# EAGLE design jangeles (EAGLE 8.3.1)
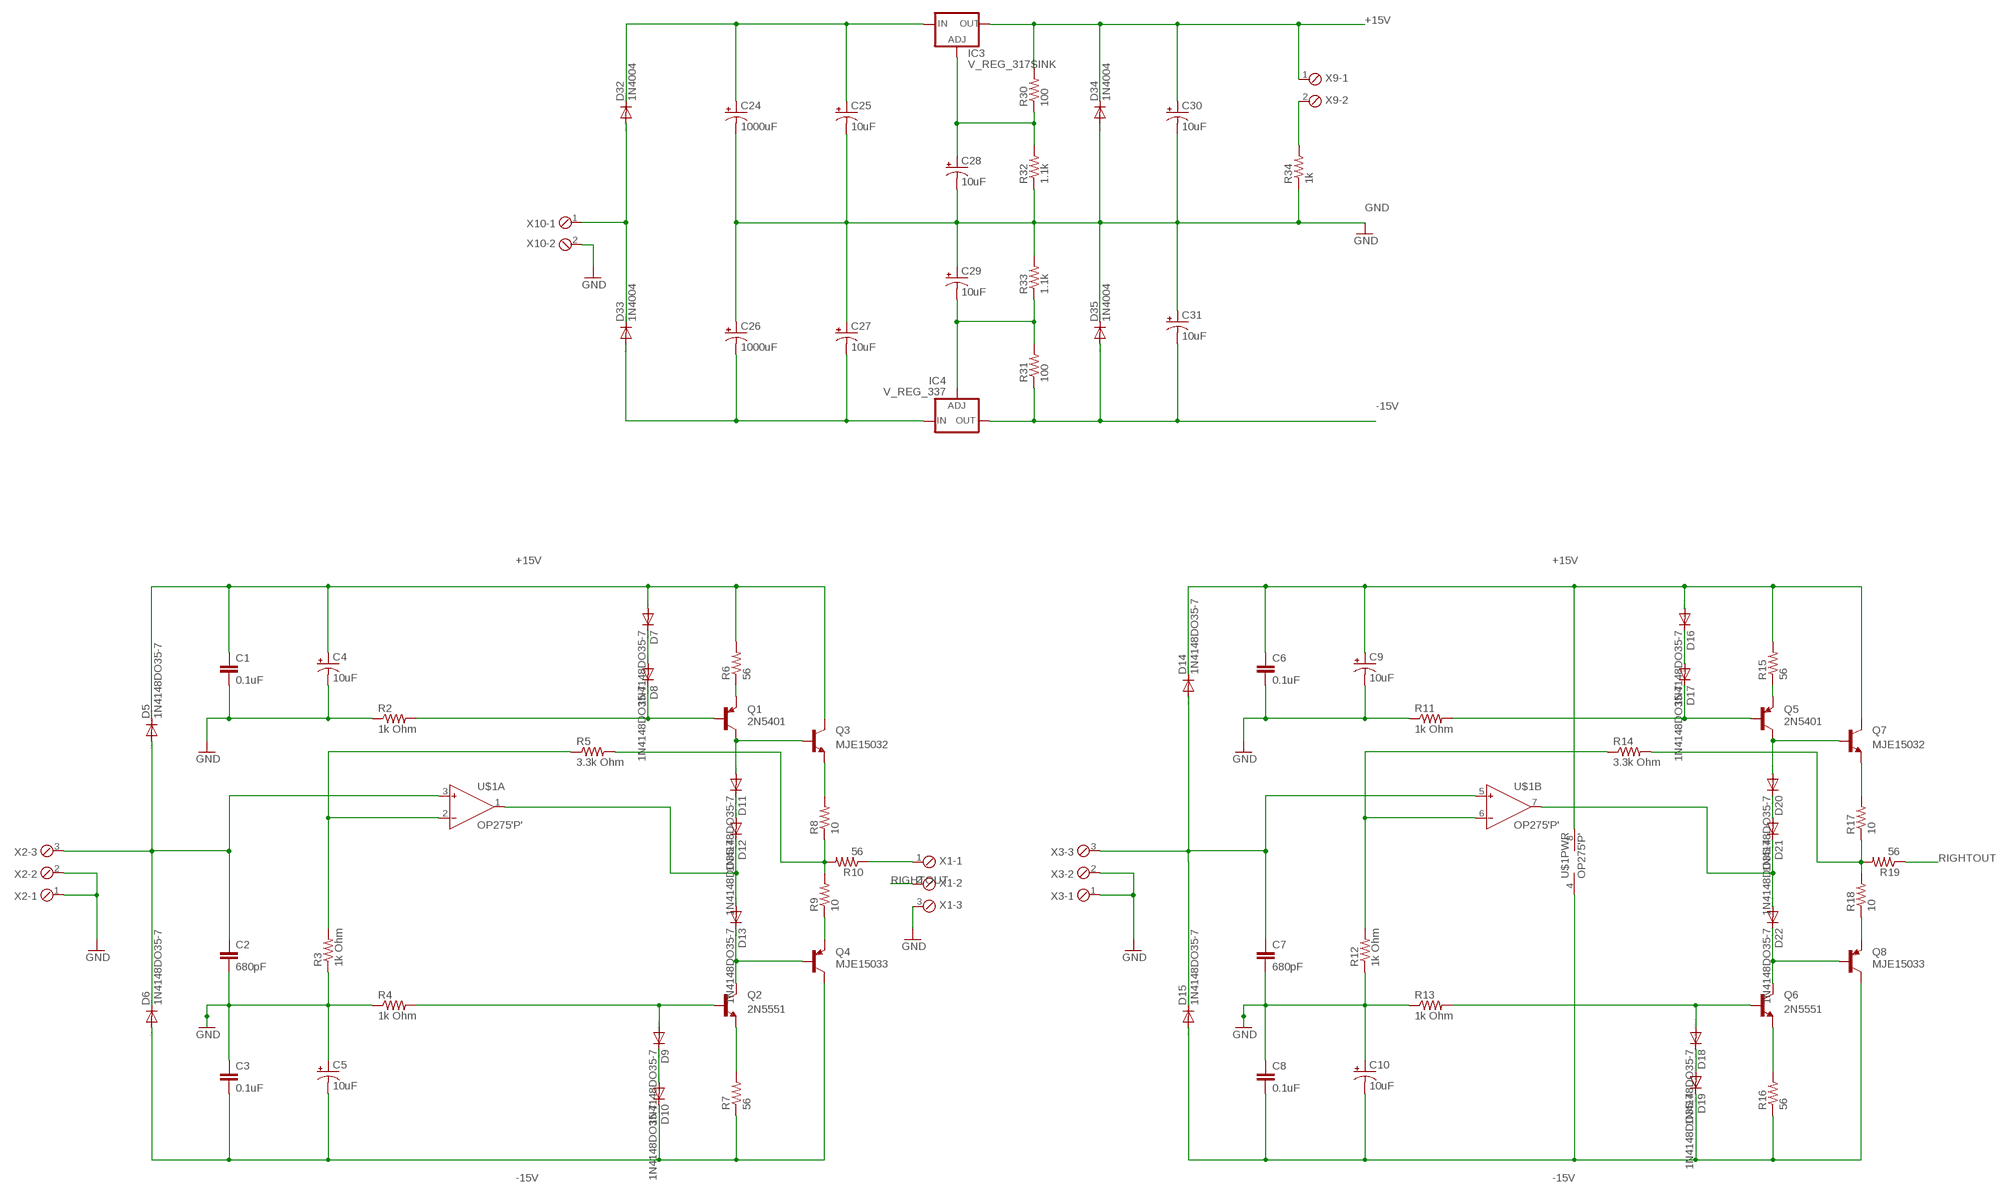
[diagram p0: schematic, sheet 1]

## Parts
C1  0.1uF  C-EU025-024X044  [C025-024X044]
C2  680pF  C-EU025-024X044  [C025-024X044]
C3  0.1uF  C-EU025-024X044  [C025-024X044]
C4  10uF  CPOL-USE2-5  [E2-5]
C5  10uF  CPOL-USE2-5  [E2-5]
C6  0.1uF  C-EU025-024X044  [C025-024X044]
C7  680pF  C-EU025-024X044  [C025-024X044]
C8  0.1uF  C-EU025-024X044  [C025-024X044]
C9  10uF  CPOL-USE2-5  [E2-5]
C10  10uF  CPOL-USE2-5  [E2-5]
C24  1000uF  CPOL-USE5-10.5  [E5-10,5]
C25  10uF  CPOL-USE2-5  [E2-5]
C26  1000uF  CPOL-USE5-10.5  [E5-10,5]
C27  10uF  CPOL-USE2-5  [E2-5]
C28  10uF  CPOL-USE2-5  [E2-5]
C29  10uF  CPOL-USE2-5  [E2-5]
C30  10uF  CPOL-USE2-5  [E2-5]
C31  10uF  CPOL-USE2-5  [E2-5]
D5  1N4148DO35-7  [DO35-7]
D6  1N4148DO35-7  [DO35-7]
D7  1N4148DO35-7  [DO35-7]
D8  1N4148DO35-7  [DO35-7]
D9  1N4148DO35-7  [DO35-7]
D10  1N4148DO35-7  [DO35-7]
D11  1N4148DO35-7  [DO35-7]
D12  1N4148DO35-7  [DO35-7]
D13  1N4148DO35-7  [DO35-7]
D14  1N4148DO35-7  [DO35-7]
D15  1N4148DO35-7  [DO35-7]
D16  1N4148DO35-7  [DO35-7]
D17  1N4148DO35-7  [DO35-7]
D18  1N4148DO35-7  [DO35-7]
D19  1N4148DO35-7  [DO35-7]
D20  1N4148DO35-7  [DO35-7]
D21  1N4148DO35-7  [DO35-7]
D22  1N4148DO35-7  [DO35-7]
D32  1N4004  [DO41-10]
D33  1N4004  [DO41-10]
D34  1N4004  [DO41-10]
D35  1N4004  [DO41-10]
IC3  V_REG_317SINK  [TO220-ADJ]
IC4  V_REG_337  [TO220-ADJ-NEG]
Q1  2N5401  [2N5401]
Q2  2N5551  [2N5551]
Q3  MJE15032  [TO220V]
Q4  MJE15033  [TO220V]
Q5  2N5401  [2N5401]
Q6  2N5551  [2N5551]
Q7  MJE15032  [TO220V]
Q8  MJE15033  [TO220V]
R2  1k Ohm  R-US_0204/5  [0204/5]
R3  1k Ohm  R-US_0204/5  [0204/5]
R4  1k Ohm  R-US_0204/5  [0204/5]
R5  3.3k Ohm  R-US_0204/5  [0204/5]
R6  56  R-US_0204/5  [0204/5]
R7  56  R-US_0204/5  [0204/5]
R8  10  R-US_0204/5  [0204/5]
R9  10  R-US_0204/5  [0204/5]
R10  56  R-US_0204/5  [0204/5]
R11  1k Ohm  R-US_0204/5  [0204/5]
R12  1k Ohm  R-US_0204/5  [0204/5]
R13  1k Ohm  R-US_0204/5  [0204/5]
R14  3.3k Ohm  R-US_0204/5  [0204/5]
R15  56  R-US_0204/5  [0204/5]
R16  56  R-US_0204/5  [0204/5]
R17  10  R-US_0204/5  [0204/5]
R18  10  R-US_0204/5  [0204/5]
R19  56  R-US_0204/5  [0204/5]
R30  100  R-US_0309/10  [0309/10]
R31  100  R-US_0309/10  [0309/10]
R32  1.1k  R-US_0204/5  [0204/5]
R33  1.1k  R-US_0204/5  [0204/5]
R34  1k  R-US_0204/5  [0204/5]
U$1  OP275'P'  [DIL08]
X1  MPT3  [3POL254]
X2  MPT3  [3POL254]
X3  MPT3  [3POL254]
X9  MPT2  [2POL254]
X10  MPT2  [2POL254]

## Nets
+15V [+15v]: C1.1 C4.+ C6.1 C9.+ C30.+ D5.C D7.A D14.C D16.A D34.C IC3.OUT Q3.2(C) Q7.2(C) R6.2 R15.2 R30.2 U$1.8(PWR:V+) X9.1
-15V [-15v]: C3.2 C5.- C8.2 C10.- C31.- D6.A D10.C D15.A D19.C D35.A IC4.OUT Q4.2(C) Q8.2(C) R7.1 R16.1 R31.1 U$1.4(PWR:V-)
GND [GND]: C1.2 C2.2 C3.1 C4.- C5.+ C6.2 C7.2 C8.1 C9.- C10.+ C24.- C25.- C26.+ C27.+ C28.- C29.+ C30.- C31.+ D34.A D35.C R2.1 R3.1 R4.1 R11.1 R12.1 R13.1 R32.1 R33.2 R34.1 X1.3 X2.1 X2.2 X3.1 X3.2 X10.2
N$1: D7.C D8.A
N$2: D9.C D10.A
N$3: Q2.E R7.2
N$4: D9.A Q2.B R4.2
N$5: R3.2 R5.1 U$1.2(A:IN-)
N$6: D18.C D19.A
N$7: Q3.3(E) R8.2
N$8: R5.2 R8.1 R9.2 R10.2
N$9: Q4.3(E) R9.1
N$10: D13.C Q2.C Q4.1(B)
N$12: D12.C D13.A U$1.1(A:OUT)
N$13: D11.C D12.A
N$14: D11.A Q1.C Q3.1(B)
N$15: Q1.E R6.1
N$16: Q6.E R16.2
N$17: D18.A Q6.B R13.2
N$18: D8.C Q1.B R2.2
N$19: Q7.3(E) R17.2
N$20: R14.2 R17.1 R18.2 R19.2
N$21: Q8.3(E) R18.1
N$22: D22.C Q6.C Q8.1(B)
N$24: D21.C D22.A U$1.7(B:OUT)
N$25: D20.C D21.A
N$26: D20.A Q5.C Q7.1(B)
N$27: Q5.E R15.1
N$28: D17.C Q5.B R11.2
N$29: R12.2 R14.1 U$1.6(B:IN-)
N$30: D16.C D17.A
N$31: R10.1 X1.1
N$57: D32.A D33.C X10.1
N$58: C26.- C27.- D33.A IC4.IN
N$60: C24.+ C25.+ D32.C IC3.IN
N$62: C29.- IC4.ADJ R31.2 R33.1
N$64: C28.+ IC3.ADJ R30.1 R32.2
N$67: R34.2 X9.2
R2: C7.1 D14.A D15.C U$1.5(B:IN+) X3.3
R5: C2.1 D5.A D6.C U$1.3(A:IN+) X2.3
RIGHTOUT: R19.1 X1.2

## Library data of the parts
C1-C3 C6-C8 = rcl:C-EU: CAPACITOR, European symbol
C4 C5 C9 C10 C24-C31 = rcl:CPOL-US: POLARIZED CAPACITOR, American symbol
D5-D22 = diode:1N4148: DIODE high speed (Philips)
D32-D35 = diode:1N4004: DIODE general purpose rectifier, 1 A
IC3 = engr301-proj :V_REG_317: Voltage Regulator Standard LM317 adjustable voltage regulator. AOI (Adjust Output Input). Google 'LM317 Calculator' for easy to use app to get the two resistor values needed. 240/720 for 5V output. 240/390 for 3.3V output. Spark Fun Electronics SKU : COM-00527
IC4 = engr301-proj :V_REG_337: LM-337 Negative Adjustable Voltage Regulator
Q1 Q5 = engr301-proj :2N5401
Q2 Q6 = engr301-proj :2N5551
Q3 Q7 = engr301-proj :MJE15032: NPN Power Transistor HF Audio Driver 8.0A, 250V, 50W
Q4 Q8 = engr301-proj :MJE15033: PNP Power Transistor HF Audio Driver 8.0A, 250V, 50W
R2-R19 R30-R34 = rcl:R-US_: RESISTOR, American symbol
U$1 = engr301-proj :OP275: OP275 - Dual Bipolar/JFET Audio Op-amp
X1-X3 = con-phoenix-254:MPT3: PHOENIX CONNECTOR; OC_FARNELL: unknown; OC_NEWARK: unknown
X9 X10 = con-phoenix-254:MPT2: PHOENIX CONNECTOR; OC_FARNELL: unknown; OC_NEWARK: unknown

## Net classes
1 +15v: width 0.762 mm
2 -15v: width 0.762 mm
3 GND: width 0.381 mm

## Board
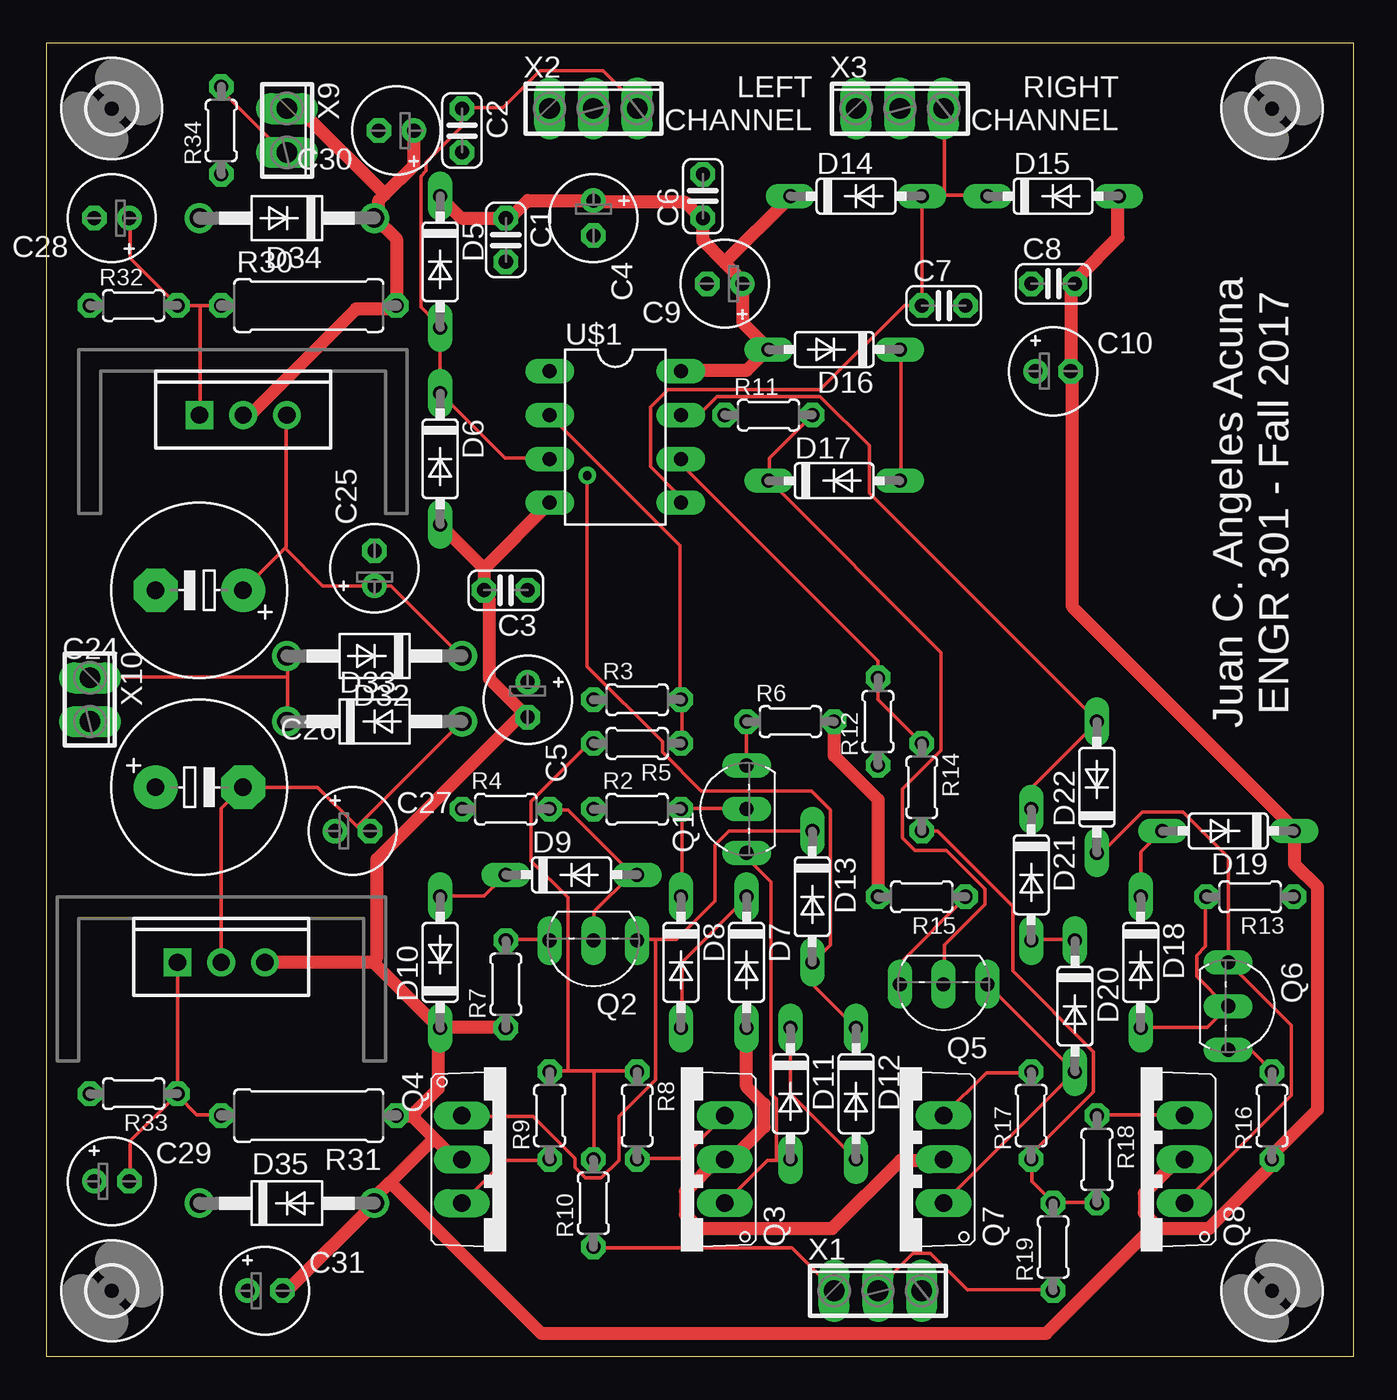
[diagram p1: board, top side]
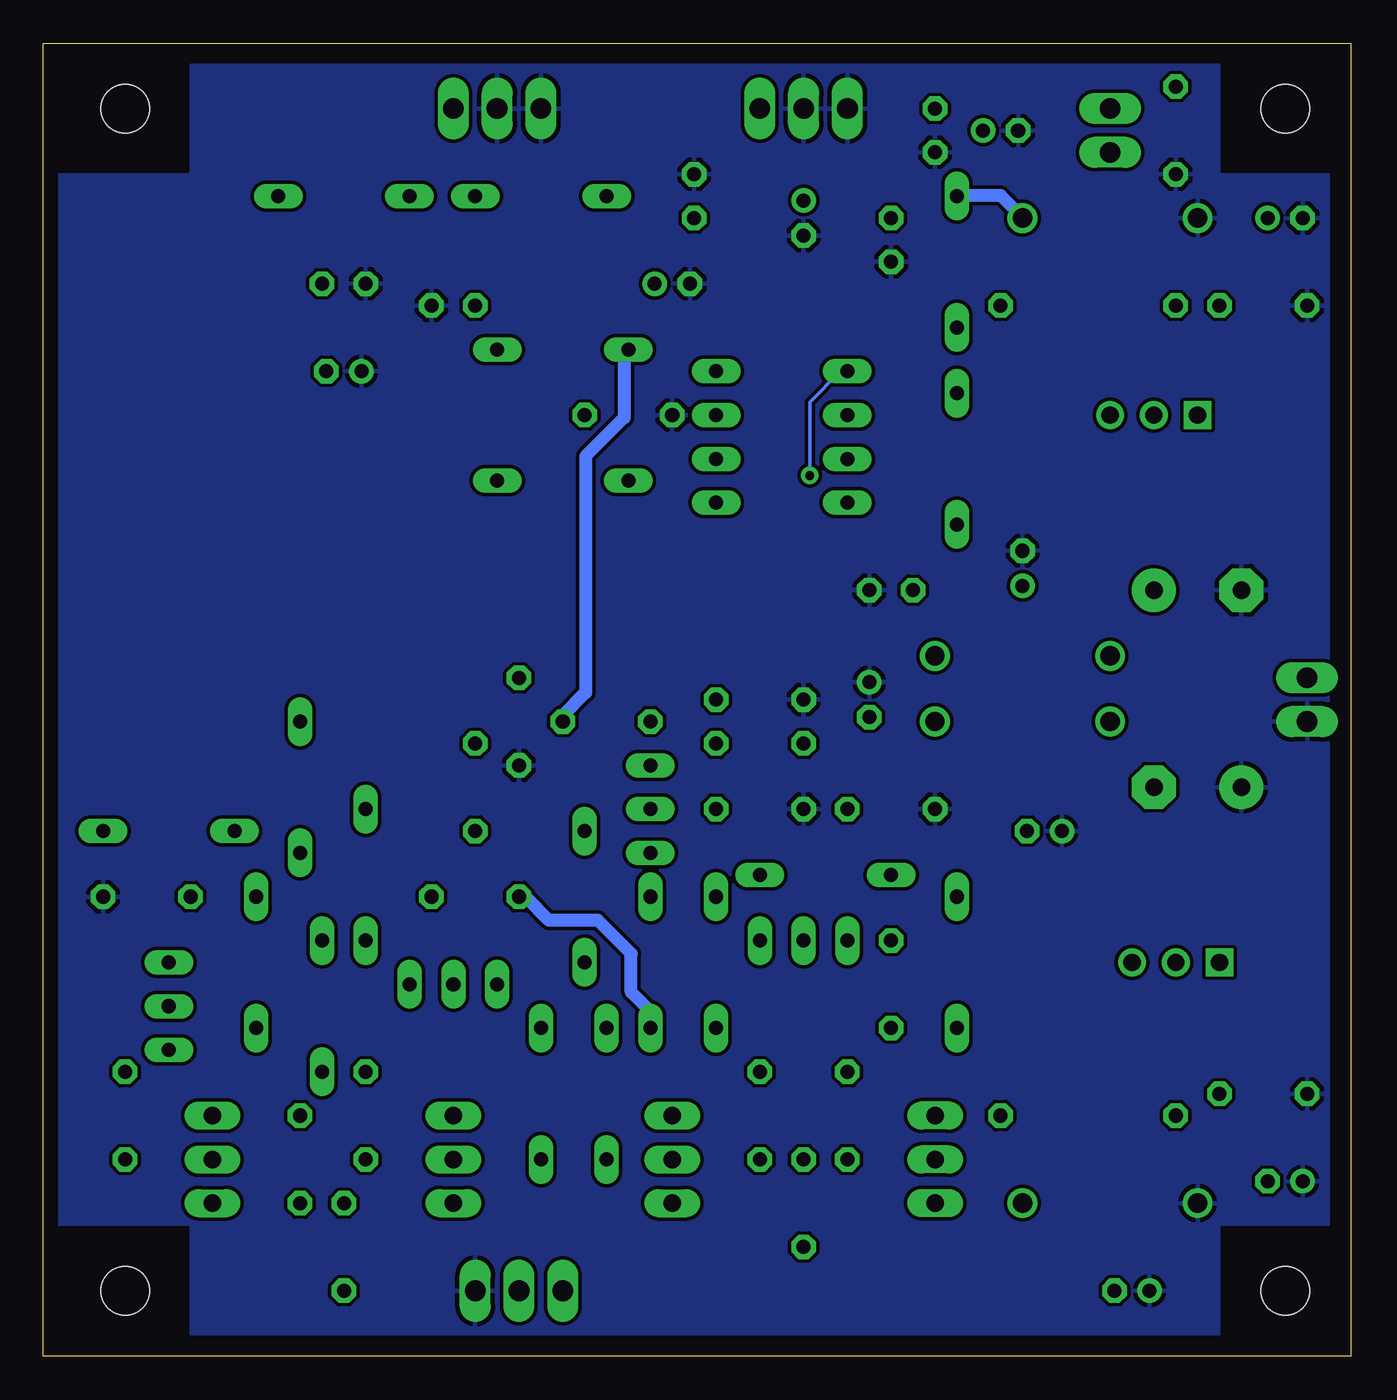
[diagram p2: board, bottom side, seen from below]

Size 75.87 x 76.19 mm. Coordinates in mm from the lower left corner, seen from the top.
Outline: 0,0 75.87,0 75.87,76.19 0,76.19 0,0
Copper layers (1*16): Top 0.035mm / dielectric 1.5mm / Bottom 0.035mm
Design rules "engr301_new": minimum track width 8mil, minimum drill 20mil, track to track 8mil, track to pad 10mil, pad to pad 10mil, via to via 10mil, smd to smd 8mil, copper to edge 15mil, drill to drill 8mil, minimum pad ring 12mil, minimum via ring 10mil, stop-mask expansion 4mil, vias tented up to drill 25mil, thermal gap 10mil

### Footprints (pad centres in the part's own frame; a part is rotated, then mirrored left to right if it is on the bottom)
C025-024X044 = drill 0.813 octagon: 1 -1.27,0; 2 1.27,0
E2-5 = drill 0.813 pad 1.27: + -1.016,0 | drill 0.813 pad 1.27 octagon: - 1.016,0
E5-10,5 = drill 1.016 pad 2.54: + -2.54,0 | drill 1.016 pad 2.54 octagon: - 2.54,0
DO35-7 = drill 0.813 long: A 3.81,0; C -3.81,0
DO41-10 = drill 1.118: A 5.08,0; C -5.08,0
TO220-ADJ = drill 1 square: ADJ -2.54,0 | drill 1: IN 2.54,0; OUT 0,0
TO220-ADJ-NEG = drill 1 square: ADJ -2.54,0 | drill 1: IN 0,0; OUT 2.54,0
2N5401 = drill 0.813 long: B 0,0; C -2.54,0; E 2.54,0
2N5551 = drill 0.813 long: B 0,0; C -2.54,0; E 2.54,0
TO220V = drill 1.016 long: 1 -2.54,-2.54; 2 0,-2.54; 3 2.54,-2.54
0204/5 = drill 0.813 octagon: 1 -2.54,0; 2 2.54,0
0309/10 = drill 0.813 octagon: 1 -5.08,0; 2 5.08,0
DIL08 = drill 0.813 long: 1 -3.81,-3.81; 2 -1.27,-3.81; 3 1.27,-3.81; 4 3.81,-3.81; 5 3.81,3.81; 6 1.27,3.81; 7 -1.27,3.81; 8 -3.81,3.81
2,8 = hole 2.8: 0,0
3POL254 = drill 1.2 long: 1 -2.54,0; 2 0,0; 3 2.54,0
2POL254 = drill 1.2 long: 1 -1.27,0; 2 1.27,0

### Placement (x,y rotation side)
C1  26.67,64.77 270 top
C2  24.13,71.12 270 top
C3  26.67,44.45 180 top
C4  31.75,66.04 270 top
C5  27.94,38.1 270 top
C6  38.1,67.31 90 top
C7  52.07,60.96 0 top
C8  58.42,62.23 0 top
C9  39.37,62.23 180 top
C10  58.42,57.15 0 top
C24  8.89,44.45 180 top
C25  19.05,45.72 90 top
C26  8.89,33.02 0 top
C27  17.78,30.48 0 top
C28  3.81,66.04 180 top
C29  3.81,10.16 0 top
C30  20.32,71.12 180 top
C31  12.7,3.81 0 top
D5  22.86,63.5 270 top
D6  22.86,52.07 270 top
D7  40.64,22.86 270 top
D8  36.83,22.86 270 top
D9  30.48,27.94 0 top
D10  22.86,22.86 90 top
D11  43.18,15.24 270 top
D12  46.99,15.24 270 top
D13  44.45,26.67 270 top
D14  46.99,67.31 0 top
D15  58.42,67.31 0 top
D16  45.72,58.42 180 top
D17  45.72,50.8 0 top
D18  63.5,22.86 270 top
D19  68.58,30.48 180 top
D20  59.69,20.32 270 top
D21  57.15,27.94 270 top
D22  60.96,33.02 90 top
D32  19.05,40.64 180 top
D33  19.05,36.83 0 top
D34  13.97,66.04 180 top
D35  13.97,8.89 0 top
IC3  11.43,54.61 0 top
IC4  10.16,22.86 0 top
Q1  40.64,31.75 90 top
Q2  31.75,24.13 180 top
Q3  36.83,11.43 90 top
Q4  26.67,11.43 270 top
Q5  52.07,21.59 180 top
Q6  68.58,20.32 270 top
Q7  49.53,11.43 90 top
Q8  63.5,11.43 90 top
R2  34.29,31.75 0 top
R3  34.29,38.1 0 top
R4  26.67,31.75 0 top
R5  34.29,35.56 180 top
R6  43.18,36.83 0 top
R7  26.67,21.59 90 top
R8  34.29,13.97 270 top
R9  29.21,13.97 90 top
R10  31.75,8.89 90 top
R11  41.91,54.61 0 top
R12  48.26,36.83 90 top
R13  69.85,26.67 180 top
R14  50.8,33.02 270 top
R15  50.8,26.67 180 top
R16  71.12,13.97 90 top
R17  57.15,13.97 90 top
R18  60.96,11.43 270 top
R19  58.42,6.35 90 top
R30  15.24,60.96 0 top
R31  15.24,13.97 180 top
R32  5.08,60.96 0 top
R33  5.08,15.24 180 top
R34  10.16,71.12 90 top
U$1  33.02,53.34 270 top
U$2  [2,8]  3.81,72.39 0 top
U$3  [2,8]  71.12,72.39 0 top
U$4  [2,8]  71.12,3.81 0 top
U$5  [2,8]  3.81,3.81 0 top
X1  48.26,3.81 0 top
X2  31.75,72.39 0 top
X3  49.53,72.39 0 top
X9  13.97,71.12 270 top
X10  2.54,38.1 270 top

### Tracks (layer width: path | path; a pad name or v marks a point on that pad's centre or on a via)
+15V
  Top 0.762: R15.2 48.26,32.31 45.72,34.85 R6.2 | D7.A 40.64,15.65 41.66,14.63 41.66,13.31 39.83,11.48 39.42,11.48 Q3.2 39.01,11.48 37.08,9.55 37.08,8.23 37.9,7.42 45.62,7.42 49.58,11.38 52.02,11.38 Q7.2 | C30.+ 21.34,69.09 19.66,67.41 | 19.66,67.41 19.3,67.06 19.3,66.34 D34.C 19.1,66.04 20.32,64.82 R30.2 20.02,60.76 17.98,60.76 11.89,54.66 11.48,54.66 IC3.OUT | 19.66,67.41 14.73,72.34 14.02,72.34 X9.1 | D5.C 22.86,67.26 24.08,66.04 C1.1 27.03,66.14 27.94,67.06 C4.+ 32.11,66.95 37.08,66.95 37.8,66.24 C6.1 38.1,64.72 39.37,63.45 | U$1.8 36.88,57.2 40.64,57.2 41.86,58.42 D16.A 41.66,58.73 40.44,59.94 40.44,62.18 C9.+ 40.23,62.59 39.37,63.45 | 39.37,63.45 43.18,67.26 D14.C
  Bottom 0.762: D7.A 40.64,20.02 41.76,21.13 41.76,23.37 43.69,25.3 46.53,25.3 47.85,26.62 48.26,26.62 R15.2 | D34.C 19.1,66.04 19.41,66.34 19.41,66.45 20.32,67.36 22.86,67.36 D5.C | R6.2 45.72,37.19 44.4,38.51 44.4,52.22 42.16,54.46 42.16,58.22 41.96,58.42 D16.A
-15V
  Top 0.762: 25.4,45.72 C3.2 25.5,44.09 25.7,43.89 25.7,39.32 C5.- 27.43,37.08 19.2,28.85 19.2,23.16 19,22.86 | D6.A 25.4,45.72 | 25.4,45.72 U$1.4 | D10.C 22.86,19.1 26.62,19.1 R7.1 | 19,22.86 IC4.OUT | 19,22.86 22.55,19.3 D10.C | 21.23,13.92 20.32,13.92 R31.1 | 22.5,12.65 23.67,11.48 24.08,11.48 Q4.2 | 22.5,12.65 21.23,13.92 | C31.- 13.72,3.86 14.02,3.86 D35.A 19.1,9.25 19.96,10.11 | 19.96,10.11 22.5,12.65 | D10.C 22.76,18.69 22.76,15.54 21.44,14.22 21.23,13.92 | D15.A 62.18,67.26 62.18,64.92 59.84,62.59 C8.2 59.44,61.98 C10.- 59.54,56.79 59.54,43.48 72.24,30.79 D19.C 72.44,30.48 72.44,28.55 73.76,27.23 73.76,14.33 71.22,11.79 R16.1 71.12,11.07 67.46,7.42 64.62,7.42 64.36,7.67 | 64.36,7.67 63.7,8.33 63.7,9.45 65.63,11.38 66.04,11.38 Q8.2 | 19.96,10.11 28.75,1.32 58.01,1.32 64.36,7.67
GND
  pour Bottom: 7.62,74.93 7.62,68.58 1.27,68.58 1.27,7.62 7.62,7.62 7.62,1.27 67.31,1.27 67.31,7.62 74.93,7.62 74.93,68.58 67.31,68.58 67.31,74.93
N$1
  Top 0.203: D8.A 36.88,19.1 36.88,22.86 40.64,26.62 D7.C
N$2
  Top 0.203: D10.A 22.86,26.72 25.4,26.72 26.62,27.94 D9.C
N$3
  Top 0.203: R7.2 26.72,24.18 29.16,24.18 Q2.E
N$4
  Top 0.203: R4.2 29.26,31.7 30.28,31.7 34.04,27.94 D9.A 33.93,27.94 31.8,25.81 31.8,24.18 Q2.B
N$5
  Top 0.203: R5.1 36.88,35.56 36.88,38.1 R3.2 36.78,38.1 36.78,47.04 U$1.2
N$6
  Top 0.203: D18.C 63.5,29.26 64.72,30.48 D19.A
N$7
  Top 0.203: Q3.3 36.88,11.48 34.34,11.48 R8.2
N$8
  Top 0.203: 31.8,16.56 34.24,16.56 R8.1 | 31.8,16.56 30.28,16.56 | 30.28,16.56 29.26,16.56 R9.2 | 31.8,16.56 31.8,11.48 R10.2 | R5.2 31.5,35.56 28.14,32.21 28.14,28.75 30.28,26.62 30.28,16.56
N$9
  Top 0.203: Q4.3 26.62,11.38 29.16,11.38 R9.1
N$10
  Top 0.203: 35.36,24.18 36.58,24.18 38.81,26.42 38.81,29.67 39.62,30.48 D13.C | 35.36,24.18 34.34,24.18 Q2.C | 35.36,24.18 35.36,16.05 33.22,13.92 33.22,11.38 32.21,10.36 31.29,10.36 30.68,10.97 30.68,11.48 28.25,13.92 24.18,13.92 Q4.1
N$12  (via drill 0.51)
  Top 0.203: 44.5,22.86 44.5,21.54 D12.C | v31.39,51.1 31.39,40.03 35.76,35.66 35.76,35.05 38,32.82 44.4,32.82 45.52,31.7 45.52,23.88 44.5,22.86 | 44.5,22.86 D13.A
  Bottom 0.203: v31.39,51.1 31.39,55.37 29.67,57.1 29.26,57.1 U$1.1
N$13
  Top 0.203: D11.C 43.18,15.24 D12.A
N$14
  Top 0.203: 42.37,11.38 41.86,11.38 Q3.1 | 42.37,11.38 43.18,11.38 D11.A | Q1.C 40.64,28.96 42.06,27.53 42.06,15.24 42.37,14.94 42.37,11.38
N$15
  Top 0.203: R6.1 Q1.E
N$16
  Top 0.203: Q6.E 69.9,17.78 71.12,16.56 R16.2
N$17
  Top 0.203: D18.A 63.5,19.1 67.36,19.1 Q6.B 68.48,20.32 66.75,22.05 66.75,23.27 67.26,23.77 67.26,26.62 R13.2
N$18
  Top 0.203: D8.C 36.88,26.72 36.88,31.7 R2.2 36.88,31.8 40.64,31.8 Q1.B
N$19
  Top 0.203: Q7.3 54.56,16.46 57.1,16.46 R17.2
N$20
  Top 0.203: 58.42,8.94 57.2,10.16 57.2,11.38 R17.1 57.2,11.48 57.2,11.79 60.76,15.34 60.76,17.68 56.08,22.35 56.08,26.11 51.71,30.48 R14.2 | 58.42,8.94 60.96,8.94 R18.2 | 58.42,8.94 R19.2
N$21
  Top 0.203: R18.1 60.96,14.02 66.04,14.02 Q8.3
N$22
  Top 0.203: D22.C 60.96,29.26 61.27,29.26 63.6,31.6 65.94,31.6 68.58,28.96 Q6.C 72.24,19.2 72.24,15.14 66.04,8.94 Q8.1
N$24
  Top 0.203: U$1.7 36.88,54.66 37.9,54.66 38.91,55.68 44.91,55.68 47.75,52.83 47.75,50.09 60.96,36.88 D22.A 60.96,36.78 57.2,33.02 57.2,31.8 D21.C
N$25
  Top 0.203: D21.A 57.2,24.18 59.64,24.18 D20.C
N$26
  Top 0.203: Q5.C D20.A Q7.1
N$27
  Top 0.203: Q5.E 49.58,21.64 49.58,22.86 53.34,26.62 R15.1
N$28
  Top 0.203: 41.96,50.8 41.96,52.12 R11.2 | 41.96,50.8 51.92,40.84 51.92,35.15 49.68,32.92 49.68,30.07 50.39,29.36 52.22,29.36 54.46,27.13 54.46,26.21 52.12,23.88 52.12,21.64 Q5.B | 41.96,50.8 D17.C
N$29
  Top 0.203: R14.1 48.26,38.1 R12.2 48.26,40.34 36.88,51.71 36.88,52.02 U$1.6
N$30
  Top 0.203: D17.A 49.58,50.8 49.58,58.42 D16.C
N$31
  Top 0.203: R10.1 31.8,6.3 43.28,6.3 45.72,3.86 X1.1
N$57
  Top 0.203: 14.02,39.42 14.02,40.64 D32.A | 14.02,39.42 14.02,36.88 D33.C | 14.02,39.42 2.54,39.42 X10.1
N$58
  Top 0.203: C27.- 18.29,30.48 18.03,30.73 | 18.03,30.73 15.75,33.02 C26.- 11.38,33.02 10.16,31.8 IC4.IN | 18.03,30.73 D33.A
N$60
  Top 0.203: D32.C 24.08,40.64 20.02,44.7 C25.+ 16.05,44.7 13.87,46.89 | C24.+ 13.87,46.89 | 13.87,46.89 13.92,46.94 13.92,54.56 IC3.IN
N$62
  Top 0.203: R33.1 4.88,12.5 4.88,10.16 C29.- | R31.2 10.16,14.02 8.74,14.02 7.62,15.14 R33.1 | R33.1 IC4.ADJ
N$64
  Top 0.203: C28.+ 4.88,66.04 4.88,63.7 R32.2 8.94,60.96 | 8.94,60.96 R30.1 | 8.94,60.96 8.94,54.66 IC3.ADJ
N$67
  Top 0.203: R34.2 10.16,73.46 13.72,69.9 13.92,69.9 X9.2
R2
  Top 0.203: 52.12,67.36 54.56,67.36 D15.C | 52.12,67.36 50.8,67.36 D14.A | 52.12,67.36 52.12,72.34 X3.3 | 52.12,67.36 D14.A | U$1.5 36.78,49.58 36.78,49.89 35.05,51.61 35.05,55.07 36.07,56.08 44.91,56.08 49.78,60.96 C7.1 D14.A
R5
  Top 0.203: X2.3 34.24,72.44 34.24,72.64 32.31,74.57 28.65,74.57 26.52,72.44 24.18,72.44 C2.1 24.08,72.34 24.08,71.32 22.05,69.29 22.05,68.78 21.74,68.48 21.74,60.86 22.86,59.74 D5.A D6.C 26.62,52.12 29.16,52.12 U$1.3
RIGHTOUT
  Top 0.203: X1.2 48.26,3.96 50.29,5.99 51.31,5.99 53.44,3.86 58.42,3.86 R19.1

### Text on the board
tPlace: LEFT / CHANNEL | RIGHT / CHANNEL | Juan C. Angeles Acuna / ENGR 301 - Fall 2017